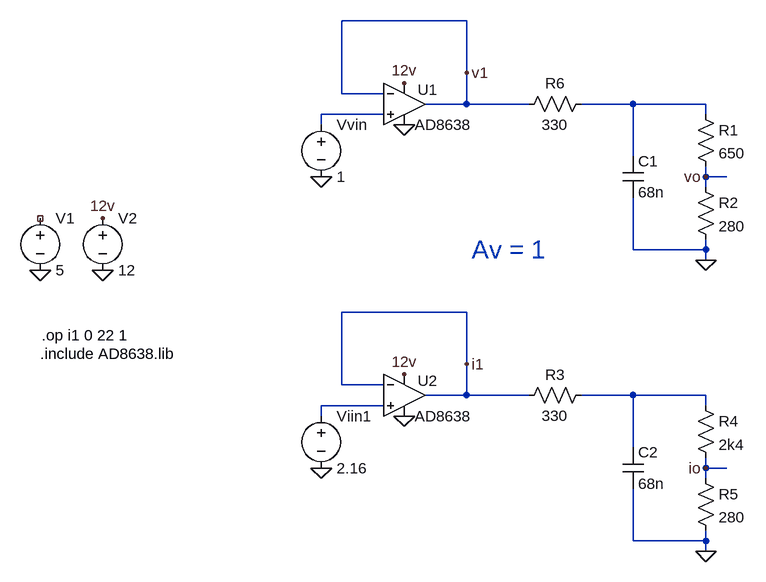
[diagram p0: schematic vi_mon.asc]
vi_mon.asc, the LTspice schematic file:
Version 4
SHEET 1 880 732
WIRE 128 -448 -64 -448
WIRE 128 -368 128 -448
WIRE -64 -336 -64 -448
WIRE 0 -336 -64 -336
WIRE 128 -320 128 -368
WIRE 128 -320 64 -320
WIRE 224 -320 128 -320
WIRE 384 -320 304 -320
WIRE 496 -320 384 -320
WIRE 0 -304 -96 -304
WIRE 496 -304 496 -320
WIRE -96 -288 -96 -304
WIRE 384 -240 384 -320
WIRE 496 -208 496 -224
WIRE 528 -208 496 -208
WIRE 496 -192 496 -208
WIRE 384 -96 384 -176
WIRE 496 -96 496 -112
WIRE 496 -96 384 -96
WIRE 496 -80 496 -96
WIRE 128 0 -64 0
WIRE 128 80 128 0
WIRE -64 112 -64 0
WIRE 0 112 -64 112
WIRE 128 128 128 80
WIRE 128 128 64 128
WIRE 224 128 128 128
WIRE 384 128 304 128
WIRE 496 128 384 128
WIRE 0 144 -96 144
WIRE 496 144 496 128
WIRE -96 160 -96 144
WIRE 384 208 384 128
WIRE 496 240 496 224
WIRE 528 240 496 240
WIRE 496 256 496 240
WIRE 384 352 384 272
WIRE 496 352 496 336
WIRE 496 352 384 352
WIRE 496 368 496 352
FLAG 32 -288 0
FLAG 32 -352 12v
FLAG -528 -64 0
FLAG 128 -368 v1
FLAG -432 -64 0
FLAG -432 -144 12v
FLAG 496 -80 0
FLAG 496 -208 vo
FLAG -96 -208 0
FLAG 32 160 0
FLAG 32 96 12v
FLAG 128 80 i1
FLAG 496 368 0
FLAG 496 240 io
FLAG -96 240 0
DATAFLAG 128 128 ""
DATAFLAG 128 -320 ""
DATAFLAG 528 240 ""
DATAFLAG 528 -208 ""
SYMBOL OpAmps\\UniversalOpAmp 32 -320 R0
WINDOW 0 21 -22 Left 2
SYMATTR InstName U1
SYMATTR SpiceModel ""
SYMATTR Value2 ""
SYMATTR SpiceLine ""
SYMATTR Value AD8638
SYMBOL voltage -528 -160 R0
WINDOW 123 0 0 Left 0
WINDOW 39 0 0 Left 0
SYMATTR InstName V1
SYMATTR Value 5
SYMBOL voltage -432 -160 R0
WINDOW 123 0 0 Left 0
WINDOW 39 0 0 Left 0
SYMATTR InstName V2
SYMATTR Value 12
SYMBOL res 320 -336 R90
WINDOW 0 0 56 VBottom 2
WINDOW 3 32 56 VTop 2
SYMATTR InstName R6
SYMATTR Value 330
SYMBOL res 480 -320 R0
SYMATTR InstName R1
SYMATTR Value 650
SYMBOL res 480 -208 R0
SYMATTR InstName R2
SYMATTR Value 280
SYMBOL cap 368 -240 R0
SYMATTR InstName C1
SYMATTR Value 68n
SYMBOL voltage -96 -304 R0
WINDOW 123 0 0 Left 0
WINDOW 39 0 0 Left 0
SYMATTR InstName Vvin
SYMATTR Value 1
SYMBOL OpAmps\\UniversalOpAmp 32 128 R0
WINDOW 0 21 -22 Left 2
SYMATTR InstName U2
SYMATTR SpiceModel ""
SYMATTR Value2 ""
SYMATTR SpiceLine ""
SYMATTR Value AD8638
SYMBOL res 320 112 R90
WINDOW 0 0 56 VBottom 2
WINDOW 3 32 56 VTop 2
SYMATTR InstName R3
SYMATTR Value 330
SYMBOL res 480 128 R0
SYMATTR InstName R4
SYMATTR Value 2k4
SYMBOL res 480 240 R0
SYMATTR InstName R5
SYMATTR Value 280
SYMBOL cap 368 208 R0
SYMATTR InstName C2
SYMATTR Value 68n
SYMBOL voltage -96 144 R0
WINDOW 123 0 0 Left 0
WINDOW 39 0 0 Left 0
SYMATTR InstName Viin1
SYMATTR Value 2.16
TEXT -526 36 Left 2 !.op i1 0 22 1
TEXT -528 64 Left 2 !.include AD8638.lib
TEXT 136 -96 Left 4 ;Av = 1

The netlist it stands for:
* vi_mon.asc
XU1 N002 v1 12v 0 v1 AD8638  ; pins In+ In- V+ V- OUT
V1 NC_01 0 5
V2 12v 0 12
R6 N001 v1 330
R1 N001 vo 650
R2 vo 0 280
C1 N001 0 68n
Vvin N002 0 1
XU2 N004 i1 12v 0 i1 AD8638  ; pins In+ In- V+ V- OUT
R3 N003 i1 330
R4 N003 io 2k4
R5 io 0 280
C2 N003 0 68n
Viin1 N004 0 2.16
.op i1 0 22 1
.include AD8638.lib
* Av = 1
.lib UniversalOpAmp1.lib
.backanno
.end